# EAGLE design Esquema 01 guilherme (EAGLE 9.6.2)
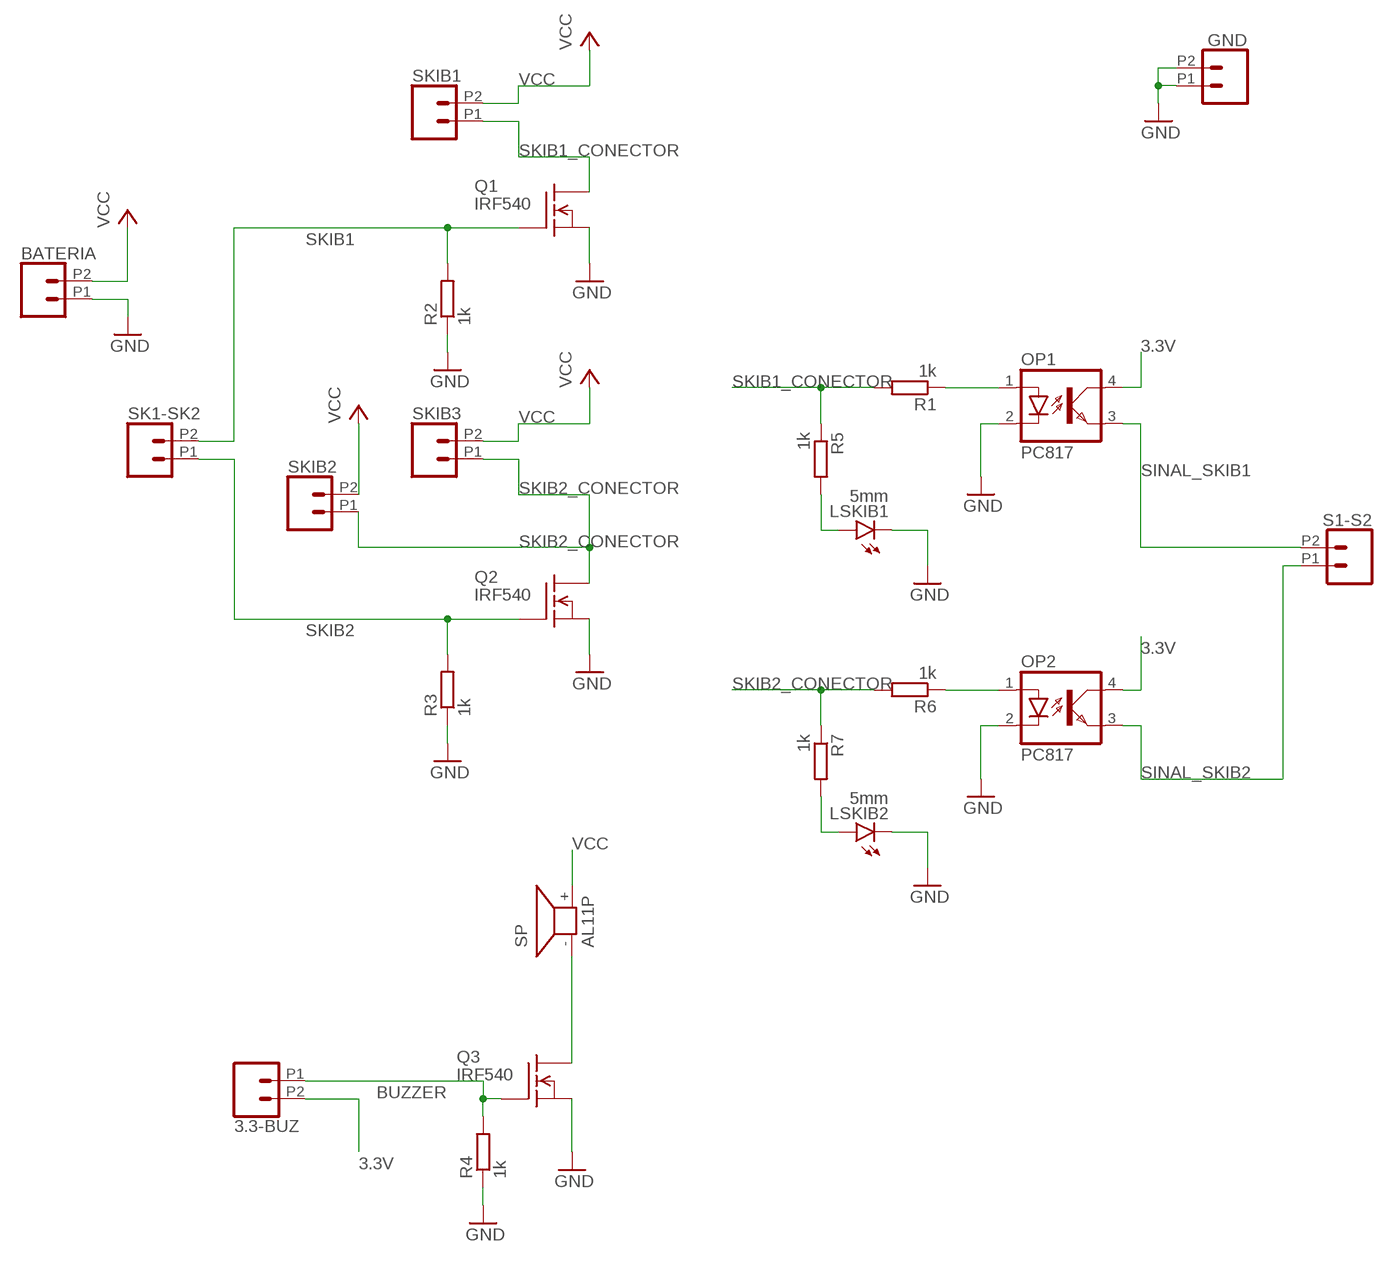
[diagram p0: schematic, sheet 1]

## Parts
3.3-BUZ  CONN_022.54MM_SCREWTERM  [1X02_2.54_SCREWTERM]
BATERIA  CONN_022.54MM_SCREWTERM  [1X02_2.54_SCREWTERM]
GND  CONN_022.54MM_SCREWTERM  [1X02_2.54_SCREWTERM]
LSKIB1  5mm  LED5MM  [LED5MM]
LSKIB2  5mm  LED5MM  [LED5MM]
OP1  PC817  [DIL04]
OP2  PC817  [DIL04]
Q1  IRF540  [TO220]
Q2  IRF540  [TO220]
Q3  IRF540  [TO220]
R1  1k  R-EU_0207/10  [0207/10]
R2  1k  R-EU_0207/10  [0207/10]
R3  1k  R-EU_0207/10  [0207/10]
R4  1k  R-EU_0207/10  [0207/10]
R5  1k  R-EU_0207/10  [0207/10]
R6  1k  R-EU_0207/10  [0207/10]
R7  1k  R-EU_0207/10  [0207/10]
S1-S2  CONN_022.54MM_SCREWTERM  [1X02_2.54_SCREWTERM]
SK1-SK2  CONN_022.54MM_SCREWTERM  [1X02_2.54_SCREWTERM]
SKIB1  CONN_022.54MM_SCREWTERM  [1X02_2.54_SCREWTERM]
SKIB2  CONN_022.54MM_SCREWTERM  [1X02_2.54_SCREWTERM]
SKIB3  CONN_022.54MM_SCREWTERM  [1X02_2.54_SCREWTERM]
SP  AL11P  [AL11P]

## Nets
3.3V: 3.3-BUZ.P2 OP1.4(COL) OP2.4(COL)
BUZZER: 3.3-BUZ.P1 Q3.1(G) R4.2
GND: BATERIA.P1 GND.P1 GND.P2 LSKIB1.K(C) LSKIB2.K(C) OP1.2(C) OP2.2(C) Q1.3(S) Q2.3(S) Q3.3(S) R2.1 R3.1 R4.1
N$1: LSKIB2.A R7.2
N$2: Q3.2(D) SP.-
N$3: LSKIB1.A R5.2
N$4: OP1.1(A) R1.1
N$5: OP2.1(A) R6.1
SINAL_SKIB1: OP1.3(EMIT) S1-S2.P2
SINAL_SKIB2: OP2.3(EMIT) S1-S2.P1
SKIB1: Q1.1(G) R2.2 SK1-SK2.P2
SKIB1_CONECTOR: Q1.2(D) R1.2 R5.1 SKIB1.P1
SKIB2: Q2.1(G) R3.2 SK1-SK2.P1
SKIB2_CONECTOR: Q2.2(D) R6.2 R7.1 SKIB2.P1 SKIB3.P1
VCC: BATERIA.P2 SKIB1.P2 SKIB2.P2 SKIB3.P2 SP.+

## Library data of the parts
3.3-BUZ BATERIA GND S1-S2 SK1-SK2 SKIB1-SKIB3 = SparkFun-Connectors:CONN_02: Multi connection point. Often used as Generic Header-pin footprint for 0.1 inch spaced/style header connections On any of the 0.1 inch spaced packages, you can populate with these: Break Away Headers - Straight <https://www.sparkfun.com/products/116> (PRT-00116) Break Away Male Headers - Right Angle <https://www.sparkfun.com/products/553> (PRT-00553) Female Headers <https://www.sparkfun.com/products/115> (PRT-00115) Break Away Headers - Machine Pin <https://www.sparkfun.com/products/117> (PRT-00117) Break Away Female Headers - Swiss Machine Pin <https://www.sparkfun.com/products/743> (PRT-00743) For SCREWTERMINALS and SPRING TERMINALS visit here: Screw Terimnals on SparkFun.com <https://www.sparkfun.com/search/results?term=Screw+Terminals> (5mm/3.5mm/2.54mm spacing) This device is also useful as a general connection point to wire up your design to another part of your project. Our various solder wires solder well into these plated through hole pads. Hook-Up Wire - Assortment (Stranded, 22 AWG) <https://www.sparkfun.com/products/11375> (PRT-11375) Hook-Up Wire - Assortment (Solid Core, 22 AWG) <https://www.sparkfun.com/products/11367> (PRT-11367) View the entire wire category on our website here <https://www.sparkfun.com/categories/141> Special notes: Molex polarized connector foot print use with: PRT-08233 with associated crimp pins and housings. 2.54_SCREWTERM for use with PRT-10571. 3.5mm Screw Terminal footprints for PRT-08084 5mm Screw Terminal footprints for use with PRT-08432
LSKIB1 LSKIB2 = led:LED: LED OSRAM: - CHIPLED LG R971, LG N971, LY N971, LG Q971, LY Q971, LO R971, LY R971 LH N974, LH R974 LS Q976, LO Q976, LY Q976 LO Q996 - Hyper CHIPLED LW Q18S LB Q993, LB Q99A, LB R99A - SideLED LS A670, LO A670, LY A670, LG A670, LP A670 LB A673, LV A673, LT A673, LW A673 LH A674 LY A675 LS A676, LA A676, LO A676, LY A676, LW A676 LS A679, LY A679, LG A679 - Hyper Micro SIDELED® LS Y876, LA Y876, LO Y876, LY Y876 LT Y87S - SmartLED LW L88C, LW L88S LB L89C, LB L89S, LG L890 LS L89K, LO L89K, LY L89K LS L896, LA L896, LO L896, LY L896 - TOPLED LS T670, LO T670, LY T670, LG T670, LP T670 LSG T670, LSP T670, LSY T670, LOP T670, LYG T670 LG T671, LOG T671, LSG T671 LB T673, LV T673, LT T673, LW T673 LH T674 LS T676, LA T676, LO T676, LY T676, LB T676, LH T676, LSB T676, LW T676 LB T67C, LV T67C, LT T67C, LS T67K, LO T67K, LY T67K, LW E67C LS E67B, LA E67B, LO E67B, LY E67B, LB E67C, LV E67C, LT E67C LW T67C LS T679, LY T679, LG T679 LS T770, LO T770, LY T770, LG T770, LP T770 LB T773, LV T773, LT T773, LW T773 LH T774 LS E675, LA E675, LY E675, LS T675 LS T776, LA T776, LO T776, LY T776, LB T776 LHGB T686 LT T68C, LB T68C - Hyper Mini TOPLED® LB M676 - Mini TOPLED Santana® LG M470 LS M47K, LO M47K, LY M47K Source: http://www.osram.convergy.de LUXEON: - LUMILED® LXK2-PW12-R00, LXK2-PW12-S00, LXK2-PW14-U00, LXK2-PW14-V00 LXK2-PM12-R00, LXK2-PM12-S00, LXK2-PM14-U00 LXK2-PE12-Q00, LXK2-PE12-R00, LXK2-PE12-S00, LXK2-PE14-T00, LXK2-PE14-U00 LXK2-PB12-K00, LXK2-PB12-L00, LXK2-PB12-M00, LXK2-PB14-N00, LXK2-PB14-P00, LXK2-PB14-Q00 LXK2-PR12-L00, LXK2-PR12-M00, LXK2-PR14-Q00, LXK2-PR14-R00 LXK2-PD12-Q00, LXK2-PD12-R00, LXK2-PD12-S00 LXK2-PH12-R00, LXK2-PH12-S00 LXK2-PL12-P00, LXK2-PL12-Q00, LXK2-PL12-R00 Source: www.luxeon.com KINGBRIGHT: KA-3528ASYC Source: www.kingbright.com
OP1 OP2 = optocoupler:PC817: SHARP OPTO COUPLER; MPN: PC817X4J000F; OC_FARNELL: 9707727; OC_NEWARK: 97K7059
Q1-Q3 = transistor-fet:IRF540: N-Channel Enhancement MOSFET (HEXFET); 100V; 28A; 0,077Ohm
R1-R7 = rcl:R-EU_: RESISTOR, European symbol; SPICEPREFIX: R
SP = buzzer:AL11P: SPEAKER Source: Buerklin; OC_FARNELL: unknown; OC_NEWARK: unknown

## Board
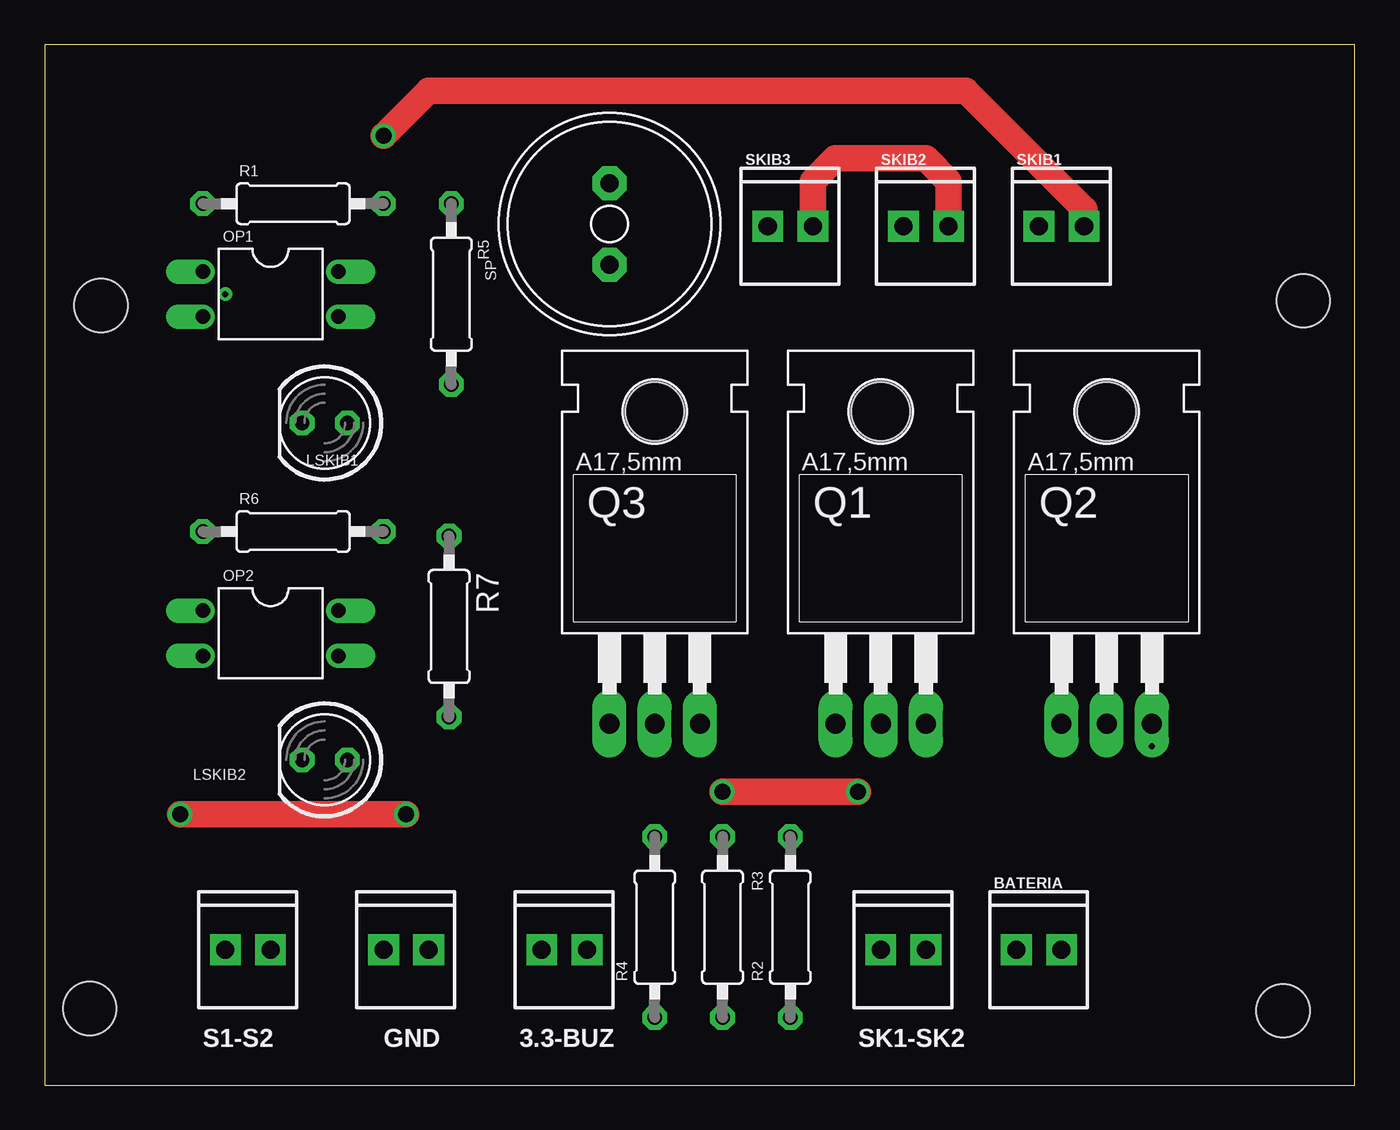
[diagram p1: board, top side]
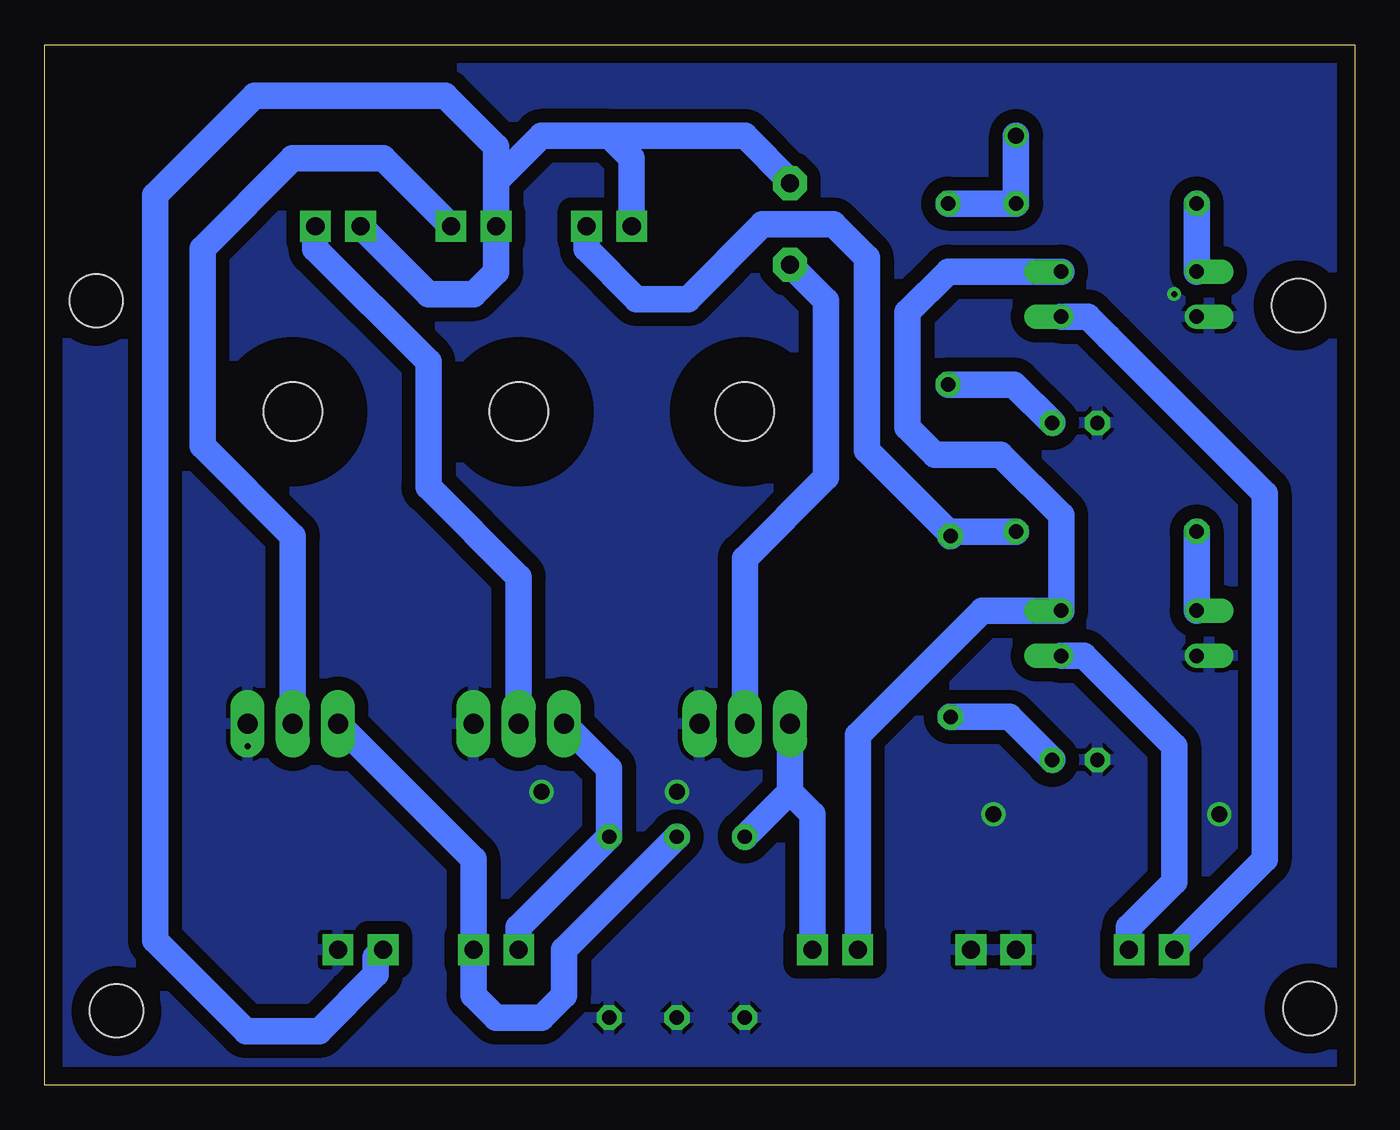
[diagram p2: board, bottom side, seen from below]

Size 73.64 x 58.47 mm. Coordinates in mm from the lower left corner, seen from the top.
Outline: 0,0 73.64,0 73.64,58.47 0,58.47 0,0
Copper layers (1*16): Top 0.035mm / dielectric 1.5mm / Bottom 0.035mm
Design rules "default": minimum track width 1.5mm, minimum drill 0.35mm, track to track 30mil, track to pad 20mil, pad to pad 6mil, via to via 6mil, smd to smd 6mil, copper to edge 40mil, drill to drill 6mil, minimum pad ring 10mil, minimum via ring 8mil, stop-mask expansion 4mil, vias tented up to drill 0mil, thermal gap 10mil
Holes 3 mm at 3.17,43.82 70.74,44.07 2.54,4.32 69.6,4.19

### Footprints (pad centres in the part's own frame; a part is rotated, then mirrored left to right if it is on the bottom)
1X02_2.54_SCREWTERM = drill 1.016 square: P1 2.54,0; P2 0,0
LED5MM = drill 0.813 octagon: A -1.27,0; K 1.27,0
DIL04 = drill 0.813 offset: 1 -1.27,-3.81; 2 1.27,-3.81; 3 1.27,3.81; 4 -1.27,3.81
TO220 = drill 1.118 long: 1 -2.54,-6.35; 2 0,-6.35; 3 2.54,-6.35 | hole 3.302: 0,11.176
0207/10 = drill 0.813 octagon: 1 -5.08,0; 2 5.08,0
AL11P = drill 1.016 pad 1.905 octagon: + 2.286,0; - -2.286,0

### Placement (x,y rotation side)
3.3-BUZ  27.94,7.62 0 top
BATERIA  54.61,7.62 0 top
GND  19.05,7.62 0 top
LSKIB1  15.75,37.21 180 top
LSKIB2  15.75,18.29 180 top
OP1  12.7,44.45 270 top
OP2  12.7,25.4 270 top
Q1  46.99,26.67 0 top
Q2  59.69,26.67 0 top
Q3  34.29,26.67 0 top
R1  13.97,49.53 0 top
R2  41.91,8.89 90 top
R3  38.1,8.89 90 top
R4  34.29,8.89 90 top
R5  22.86,44.45 270 top
R6  13.97,31.11 0 top
R7  22.73,25.78 270 top
S1-S2  10.16,7.62 0 top
SK1-SK2  46.99,7.62 0 top
SKIB1  55.88,48.26 0 top
SKIB2  48.26,48.26 0 top
SKIB3  40.64,48.26 0 top
SP  31.75,48.39 90 top

### Tracks (layer width: path | path; a pad name or v marks a point on that pad's centre or on a via)
3.3V
  Bottom 1.5: OP1.4 22.86,45.72 25.15,43.43 25.15,36.98 23.6,35.43 19.91,35.43 16.51,32.03 OP2.4 20.93,26.67 27.94,19.66 3.3-BUZ.P2
BUZZER
  Bottom 1.5: 31.75,16.51 Q3.1 | 31.75,16.51 30.48,15.24 3.3-BUZ.P1 | R4.2 31.75,16.51
GND  (via drill 0.35, 0.9)
  Top 1.5: v38.1,16.51 v45.72,16.51 | v20.32,15.24 v7.62,15.24
  other vias: 10.16,44.45 62.23,19.05
  pour Bottom: 0.38,58.04 0.38,0.38 73.28,0.38 73.28,58.04
N$1
  Bottom 1.5: R7.2 19.43,20.7 LSKIB2.A
N$2
  Bottom 1.5: Q3.2 34.29,29.59 29.72,34.16 29.72,44.07 SP.-
N$3
  Bottom 1.5: LSKIB1.A 19.18,39.37 R5.2
N$4
  Bottom 1.5: OP1.1 R1.1
N$5
  Bottom 1.5: R6.1 OP2.1
SINAL_SKIB1
  Bottom 1.5: OP1.3 15.01,43.18 13.86,42.02 5.08,33.25 5.08,12.7 S1-S2.P2
SINAL_SKIB2
  Bottom 1.5: OP2.3 15.24,24.13 10.16,19.05 10.16,11.43 12.7,8.89 S1-S2.P1
SKIB1
  Bottom 1.5: SK1-SK2.P2 46.99,8.89 R2.2 41.91,17.78 Q1.1
SKIB1_CONECTOR  (via drill 0.9)
  Top 1.5: SKIB1.P1 58.42,49.23 51.77,55.88 21.59,55.88 v19.05,53.34
  Bottom 1.5: Q1.2 46.99,28.54 52.07,33.62 52.07,40.64 58.42,46.99 SKIB1.P1 | R5.1 R1.2 v19.05,53.34
SKIB2
  Bottom 1.5: Q2.1 49.53,12.7 SK1-SK2.P1 49.53,5.08 48.26,3.81 45.72,3.81 44.45,5.08 44.45,7.62 R3.2
SKIB2_CONECTOR
  Top 1.5: SKIB2.P1 50.8,50.8 49.53,52.07 44.45,52.07 43.18,50.8 SKIB3.P1
  Bottom 1.5: Q2.2 59.69,30.86 64.76,35.93 64.76,47 59.69,52.07 54.61,52.07 SKIB2.P1 | SKIB3.P1 43.18,46.99 40.36,44.17 37.49,44.17 33.3,48.36 29.31,48.36 27.43,46.48 27.43,35.69 22.86,31.11 R6.2 22.48,31.11 R7.1
VCC
  Bottom 1.5: SKIB2.P2 48.26,52.73 51.13,55.6 61.83,55.6 67.43,50 67.43,8.17 62.31,3.05 58.22,3.05 55.03,6.23 55.03,7.2 BATERIA.P2 | SKIB3.P2 40.64,52.07 41.91,53.34 | 41.91,53.34 45.72,53.34 48.26,50.8 SKIB2.P2 | SKIB1.P2 52.07,44.45 49.53,44.45 48.26,45.72 SKIB2.P2 | 41.91,53.34 34.29,53.34 31.75,50.8 SP.+